# EAGLE schematic tinyvoltmeter (EAGLE 6.0)
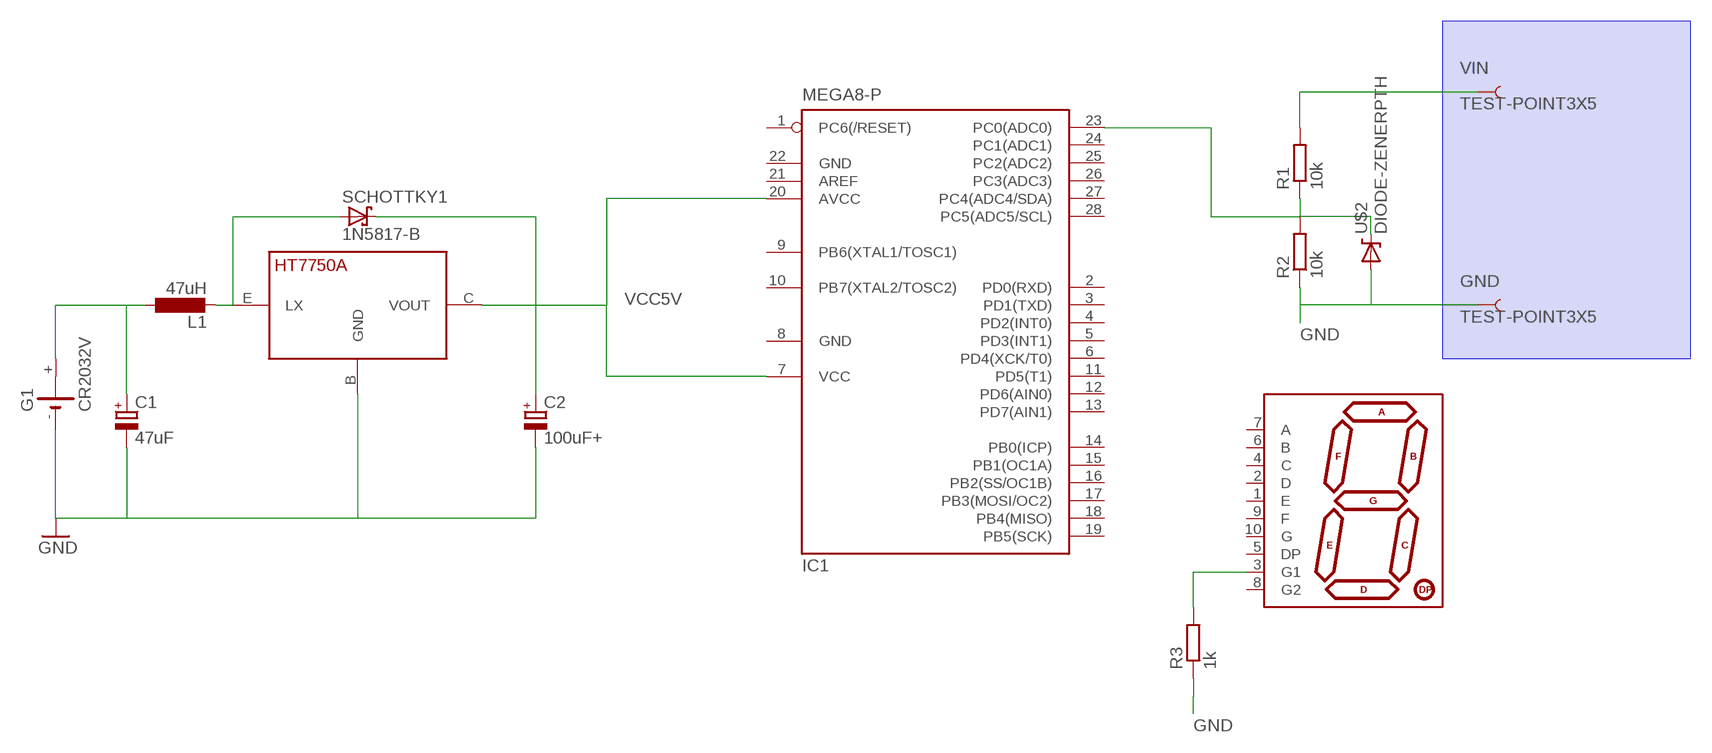
[diagram p0: schematic, sheet 1]

## Parts
C1  47uF  CPOL-EUE2.5-6  [E2,5-6]
C2  100uF+  CPOL-EUE2.5-6  [E2,5-6]
G1  CR2032V  [CR2032V]
GND  TEST-POINT3X5  [PAD.03X.05]
IC1  MEGA8-P  [DIL28-3]
L1  47uH  L-EU0204/5  [0204/5]
R1  10k  R-EU_0204/7  [0204/7]
R2  10k  R-EU_0204/7  [0204/7]
R3  1k  R-EU_0204/7  [0204/7]
SCHOTTKY1  1N5817-B  [DO41-7.6]
U$1  HT7750A  [TO92]
U$2  DIODE-ZENERPTH  [DIODE-ZENER]
U$3  7-SEGMENT-DISPLAYPTH  [7-SEGMENT-DISPLAY]
VIN  TEST-POINT3X5  [PAD.03X.05]

## Nets
GND: C1.- C2.- G1.- GND.P$1 R2.1 R3.1 U$1.B(GND) U$2.P$2(A)
N$1: R3.2 U$3.3(G1)
N$2: L1.2 SCHOTTKY1.A U$1.E(LX)
N$3: C1.+ G1.+ L1.1
N$5: IC1.23(PC0(ADC0)) R1.1 R2.2 U$2.P$1(C)
VCC5V: C2.+ IC1.7(VCC) IC1.20(AVCC) SCHOTTKY1.C U$1.C(VOUT)
VIN: R1.2 VIN.P$1
Unconnected: G1.+@1(+) IC1.1(PC6(/RESET)) IC1.2(PD0(RXD)) IC1.3(PD1(TXD)) IC1.4(PD2(INT0)) IC1.5(PD3(INT1)) IC1.6(PD4(XCK/T0)) IC1.9(PB6(XTAL1/TOSC1)) IC1.10(PB7(XTAL2/TOSC2)) IC1.11(PD5(T1)) IC1.12(PD6(AIN0)) IC1.13(PD7(AIN1)) IC1.14(PB0(ICP)) IC1.15(PB1(OC1A)) IC1.16(PB2(SS/OC1B)) IC1.17(PB3(MOSI/OC2)) IC1.18(PB4(MISO)) IC1.19(PB5(SCK)) IC1.21(AREF) IC1.24(PC1(ADC1)) IC1.25(PC2(ADC2)) IC1.26(PC3(ADC3)) IC1.27(PC4(ADC4/SDA)) IC1.28(PC5(ADC5/SCL)) U$3.1(E) U$3.2(D) U$3.4(C) U$3.5(DP) U$3.6(B) U$3.7(A) U$3.8(G2) U$3.9(F) U$3.10(G)

## Power pins joined to a net without a drawn wire
GND: IC1.8(GND) IC1.22(GND)

## Library data of the parts
C1 C2 = resistor:CPOL-EU: POLARIZED CAPACITOR, European symbol
G1 = battery:CR2032V: LI BATTERY Varta
GND VIN = SparkFun:TEST-POINT
IC1 = atmel:MEGA8-P: MICROCONTROLLER 8 Kbytes FLASH, 1 kbytes SRAM, 512 bytes EEPROM, USART, 4-channel 10 bit ADC, 2-channel 8 bit ADC Pin compatible with Atmega48, ATMega88, ATMega168 Source: avr.lbr; OC_FARNELL: unknown; OC_NEWARK: unknown
L1 = resistor:L-EU: INDUCTOR, European symbol
R1-R3 = resistor:R-EU_: RESISTOR, European symbol
SCHOTTKY1 = diode:1N581*: 1.0A SCHOTTKY BARRIER RECTIFIER Source: http://www.diodes.com/datasheets/ds23001.pdf
U$1 = kalshagar:HT7750A: HT7750A DC-DC converter 5v in a TO92 package.
U$2 = SparkFun:DIODE-ZENER: Zener Diode Production Part - 8199 3.4V Zener Voltage
U$3 = SparkFun:7-SEGMENT-DISPLAY